# EAGLE design RFID-Reader-v11 (EAGLE 5.10)
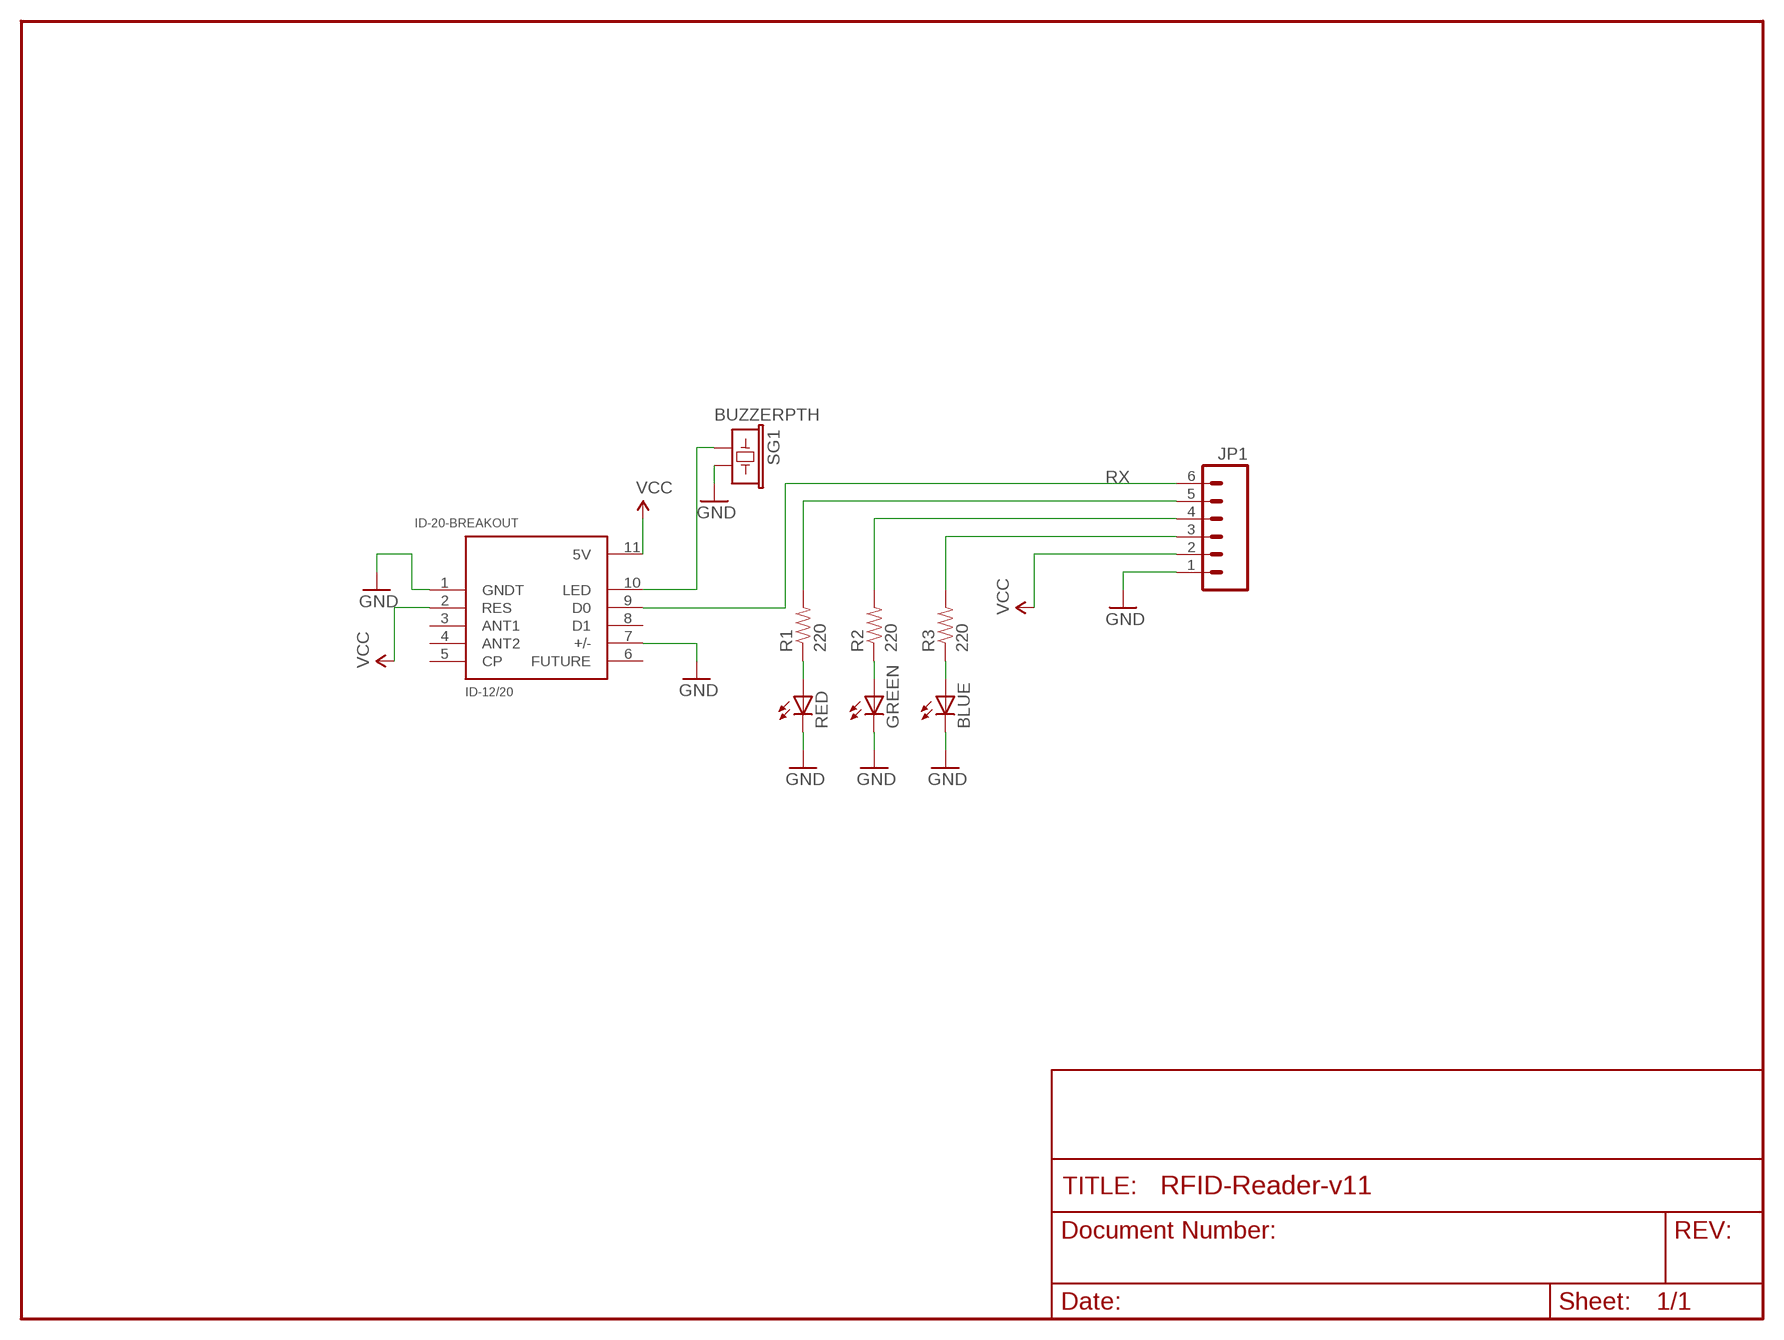
[diagram p0: schematic, sheet 1]

## Parts
BLUE  LED5MM  [LED5MM]
GREEN  LED5MM  [LED5MM]
ID-20-BREAKOUT  ID-12/20  [ID-12]
JP1  M06POLAR  [MOLEX-1X6]
R1  220  RESISTORPTH1  [AXIAL-0.3]
R2  220  RESISTORPTH1  [AXIAL-0.3]
R3  220  RESISTORPTH1  [AXIAL-0.3]
RED  LED5MM  [LED5MM]
SG1  BUZZERPTH  [BUZZER-12MM]

## Nets
GND: BLUE.K(C) GREEN.K(C) ID-20-BREAKOUT.1(GNDT) ID-20-BREAKOUT.7(+/-) JP1.1 RED.K(C) SG1.-
N$1: JP1.3 R3.P$2
N$2: BLUE.A R3.P$1
N$3: JP1.4 R2.P$2
N$4: GREEN.A R2.P$1
N$5: JP1.5 R1.P$2
N$6: R1.P$1 RED.A
N$7: ID-20-BREAKOUT.10(LED) SG1.+
RX: ID-20-BREAKOUT.9(D0) JP1.6
VCC: ID-20-BREAKOUT.2(RES) ID-20-BREAKOUT.11(5V) JP1.2
Unconnected: ID-20-BREAKOUT.3(ANT1) ID-20-BREAKOUT.4(ANT2) ID-20-BREAKOUT.5(CP) ID-20-BREAKOUT.6(FUTURE) ID-20-BREAKOUT.8(D1)

## Library data of the parts
BLUE GREEN RED = SparkFun:LED: LEDs Standard schematic elements and footprints for 5mm, 3mm, 1206, and 0603 sized LEDs. 5mm - Spark Fun Electronics SKU : COM-00529 (and others)
ID-20-BREAKOUT = SparkFun:ID-12/20: ID2, ID12, and ID20 Package
JP1 = SparkFun:M06: Header 6 Standard 6-pin 0.1" header. Use with straight break away headers (SKU : PRT-00116), right angle break away headers (PRT-00553), swiss pins (PRT-00743), machine pins (PRT-00117), and female headers (PRT-00115). Molex polarized connector foot print use with SKU : PRT-08094 with associated crimp pins and housings. NOTES ON THE VARIANTS LOCK and LOCK_LONGPADS... This footprint was designed to help hold the alignment of a through-hole component (i.e. 6-pin header) while soldering it into place. You may notice that each hole has been shifted either up or down by 0.005 of an inch from it's more standard position (which is a perfectly straight line). This slight alteration caused the pins (the squares in the middle) to touch the edges of the holes. Because they are alternating, it causes a "brace" to hold the component in place. 0.005 has proven to be the perfect amount of "off-center" position when using our standard breakaway headers. Although looks a little odd when you look at the bare footprint, once you have a header in there, the alteration is very hard to notice. Also, if you push a header all the way into place, it is covered up entirely on the bottom side. This idea of altering the position of holes to aid alignment will be further integrated into the Sparkfun Library for other footprints. It can help hold any component with 3 or more connection pins.
R1-R3 = SparkFun:RESISTOR: Resistor Basic schematic elements and footprints for 0603, 1206, and PTH 1/10th watt (small) resistors.
SG1 = SparkFun:BUZZER: Buzzer 12mm Spark Fun Electronics SKU : Comp-Buzzer

## Board
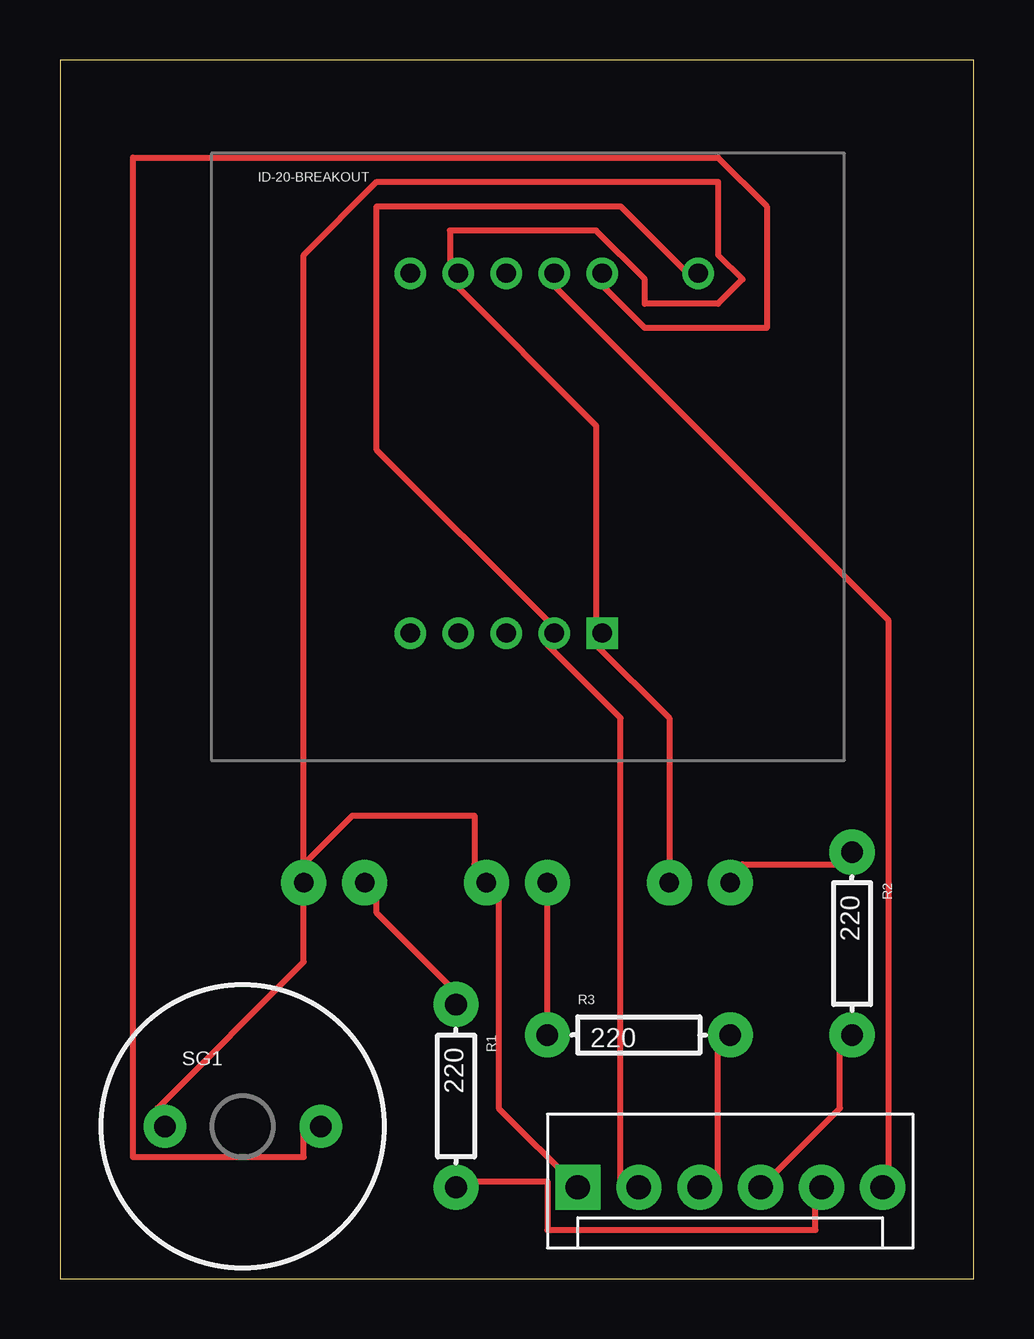
[diagram p1: board, top side]
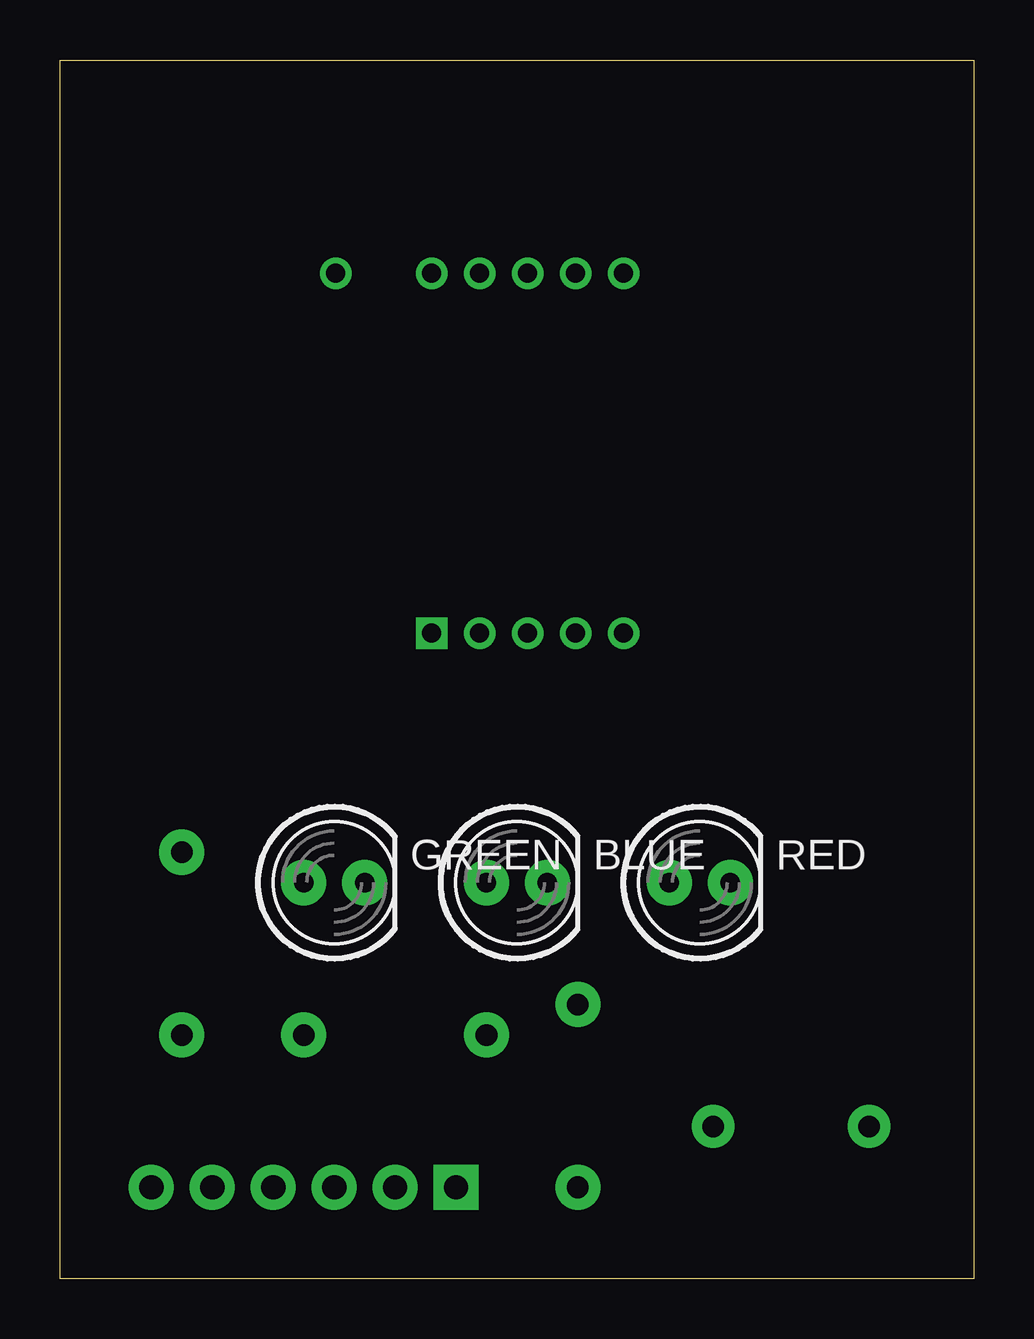
[diagram p2: board, bottom side, seen from below]

Size 38.1 x 50.8 mm. Coordinates in mm from the lower left corner, seen from the top.
Outline: 0,0 38.1,0 38.1,50.8 0,50.8 0,0
Copper layers 1: Top 0.035mm
Design rules "default *": minimum track width 10mil, minimum drill 24mil, track to track 8mil, track to pad 8mil, pad to pad 8mil, via to via 8mil, smd to smd 8mil, copper to edge 40mil, drill to drill 8mil, minimum pad ring 10mil, minimum via ring 8mil, stop-mask expansion 4mil, vias tented up to drill 0mil, thermal gap 10mil

### Footprints (pad centres in the part's own frame; a part is rotated, then mirrored left to right if it is on the bottom)
LED5MM = drill 0.813 pad 1.88 round: A -1.27,0; K 1.27,0
ID-12 = drill 0.8 square: 1 16.255,5.32 | drill 0.8 round: 2 14.255,5.32; 3 12.255,5.32; 4 10.255,5.32; 5 8.255,5.32; 6 8.255,20.32; 7 10.255,20.32; 8 12.255,20.32; 9 14.255,20.32; 10 16.255,20.32; 11 20.255,20.32
MOLEX-1X6 = drill 1.016 pad 1.88 square: 1 0,0 | drill 1.016 pad 1.88 round: 2 2.54,0; 3 5.08,0; 4 7.62,0; 5 10.16,0; 6 12.7,0
AXIAL-0.3 = drill 0.9 pad 1.88 round: P$1 -3.81,0; P$2 3.81,0
BUZZER-12MM = drill 0.9 pad 1.778 round: + 3.25,0; - -3.25,0

### Placement (x,y rotation side)
BLUE  19.05,16.51 0 bottom
GREEN  26.67,16.51 0 bottom
ID-20-BREAKOUT  6.35,21.59 0 top
JP1  21.59,3.81 0 top
R1  16.51,7.62 270 top
R2  33.02,13.97 270 top
R3  24.13,10.16 0 top
RED  11.43,16.51 0 bottom
SG1  7.62,6.35 0 top

### Tracks (layer width: path | path; a pad name or v marks a point on that pad's centre or on a via)
GND
  Top 0.254: SG1.- 4.06,7.11 10.16,13.21 RED.K 10.16,17.27 | JP1.1 18.29,7.11 18.29,16.26 BLUE.K 17.27,17.27 17.27,19.3 12.19,19.3 10.16,17.27 | GREEN.K 25.4,23.37 22.35,26.42 ID-20-BREAKOUT.1 22.35,27.43 22.35,35.56 16.26,41.66 | 10.16,17.27 10.16,42.67 13.21,45.72 27.43,45.72 27.43,42.67 28.45,41.66 27.43,40.64 24.38,40.64 24.38,41.66 22.35,43.69 16.26,43.69 16.26,41.66 | 16.26,41.66 ID-20-BREAKOUT.7
N$1
  Top 0.254: JP1.3 27.43,4.06 27.43,10.16 R3.P$2
N$2
  Top 0.254: R3.P$1 BLUE.A
N$3
  Top 0.254: JP1.4 32.51,7.11 32.51,10.16 R2.P$2
N$4
  Top 0.254: GREEN.A 28.45,17.27 32.51,17.27 R2.P$1
N$5
  Top 0.254: R1.P$2 17.27,4.06 20.32,4.06 20.32,2.03 31.5,2.03 31.5,3.05 JP1.5
N$6
  Top 0.254: R1.P$1 16.26,12.19 13.21,15.24 13.21,16.26 RED.A
N$7
  Top 0.254: ID-20-BREAKOUT.10 22.35,41.66 24.38,39.62 29.46,39.62 29.46,44.7 27.43,46.74 3.05,46.74 3.05,5.08 10.16,5.08 10.16,6.1 SG1.+
RX
  Top 0.254: ID-20-BREAKOUT.9 20.32,41.66 34.54,27.43 34.54,4.06 JP1.6
VCC
  Top 0.254: JP1.2 23.37,4.06 23.37,23.37 20.32,26.42 ID-20-BREAKOUT.2 20.32,27.43 13.21,34.54 13.21,44.7 23.37,44.7 26.42,41.66 ID-20-BREAKOUT.11